# EAGLE design webserver (EAGLE 5.10)
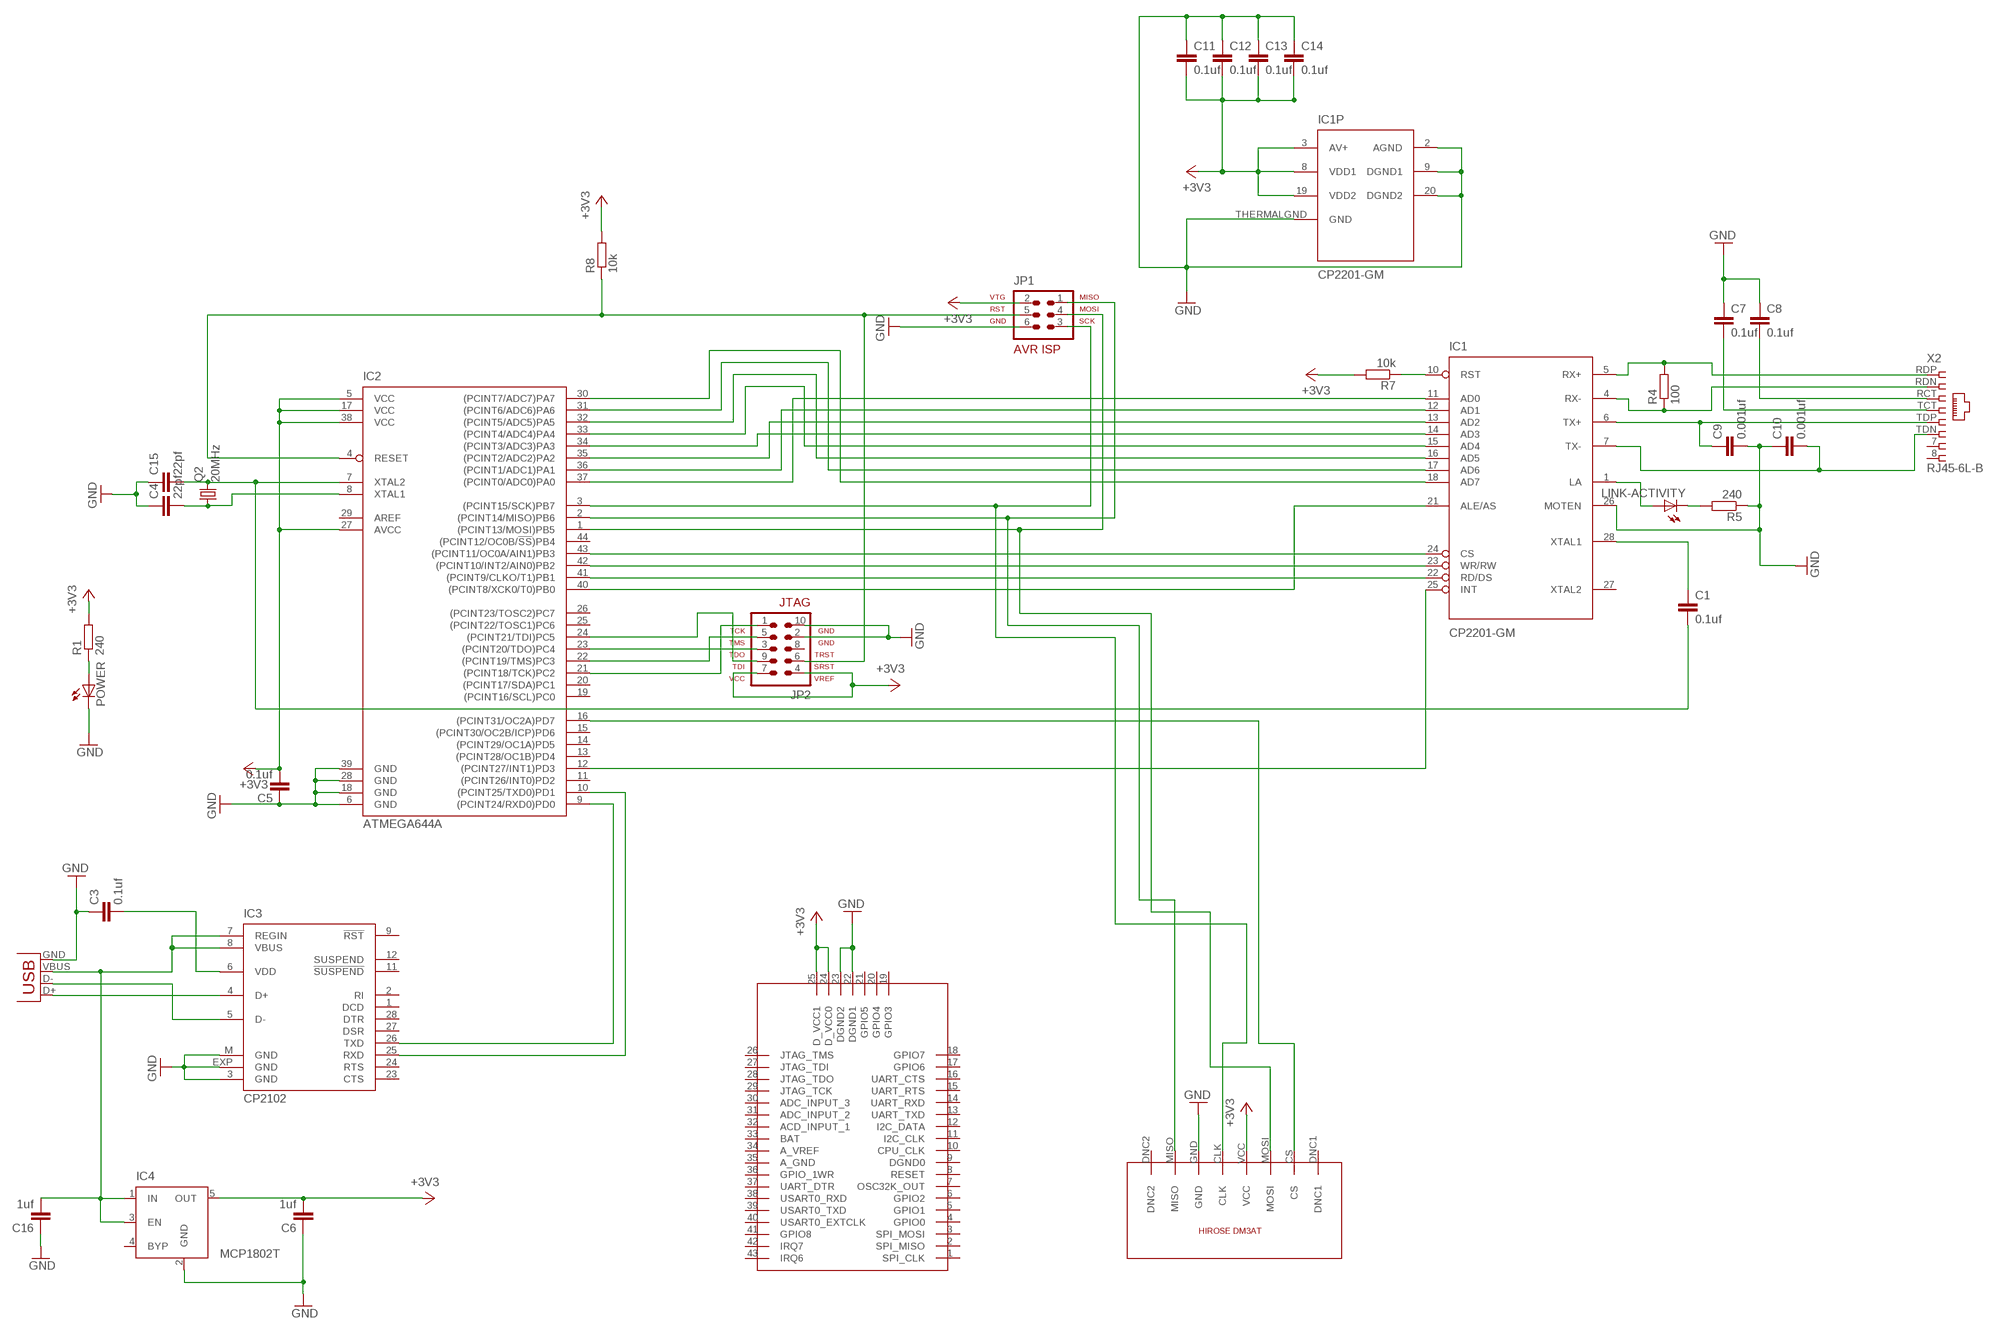
[diagram p0: schematic, sheet 1]

## Parts
C1  0.1uf  C-EUC0603  [C0603]
C3  0.1uf  C-EUC0603  [C0603]
C4  22pf  C-EUC0603  [C0603]
C5  0.1uf  C-EUC0603  [C0603]
C6  1uf  C-EUC0603  [C0603]
C7  0.1uf  C-EUC0603  [C0603]
C8  0.1uf  C-EUC0603  [C0603]
C9  0.001uf  C-EUC0603  [C0603]
C10  0.001uf  C-EUC0603  [C0603]
C11  0.1uf  C-EUC0603  [C0603]
C12  0.1uf  C-EUC0603  [C0603]
C13  0.1uf  C-EUC0603  [C0603]
C14  0.1uf  C-EUC0603  [C0603]
C15  22pf  C-EUC0603  [C0603]
C16  1uf  C-EUC0603  [C0603]
IC1  CP2201-GM  [QFN-28]
IC2  ATMEGA644A  [TQFP44]
IC3  CP2102  [MLP28]
IC4  MCP1802T  MIC5219XX  [SOT23-5]
JP1  AVR-ISP-6  [AVR-ISP-6]
JP2  AVR-JTAG-10  [AVR-JTAG-10]
LINK-ACTIVITY  LED3MM  [LED3MM]
MINI-USB  USB-MB-H  [USB-MB-H]
POWER  LED3MM  [LED3MM]
Q2  20MHz  CRYTALHC49S  [HC49/S]
R1  240  R-EU_R0603  [R0603]
R4  100  R-EU_R0603  [R0603]
R5  240  R-EU_R0603  [R0603]
R7  10k  R-EU_R0603  [R0603]
R8  10k  R-EU_R0603  [R0603]
U$1  DM3AT  [DM3AT]
U$2  ATZB-24  [ATZB-24-A2]
X2  RJ45-6L-B  [RJ45-NO-SHIELD]

## Nets
+3V3: C5.2 C6.2 C11.2 C12.2 C13.2 C14.2 IC1.3(AV+) IC1.8(VDD1) IC1.19(VDD2) IC2.5(VCC) IC2.17(VCC) IC2.27(AVCC) IC2.38(VCC) IC4.5(OUT) JP1.2 JP2.4 JP2.7 R1.2 R7.2 R8.2 U$1.VCC U$2.24(D_VCC0) U$2.25(D_VCC1)
GND: C3.1 C4.1 C5.1 C6.1 C7.1 C8.1 C9.2 C10.1 C11.1 C12.1 C13.1 C14.1 C15.1 C16.1 IC1.2(AGND) IC1.9(DGND1) IC1.20(DGND2) IC1.26(MOTEN) IC1.THERMALGND(GND) IC2.6(GND) IC2.18(GND) IC2.28(GND) IC2.39(GND) IC3.3(GND) IC3.EXP(GND) IC3.M(GND) IC4.2(GND) JP1.6 JP2.2 JP2.10 MINI-USB.GND POWER.K(C) R5.1 U$1.GND U$2.22(DGND1) U$2.23(DGND2)
N$1: IC1.11(AD0) IC2.37((PCINT0/ADC0)PA0)
N$2: IC1.12(AD1) IC2.36((PCINT1/ADC1)PA1)
N$3: IC1.13(AD2) IC2.35((PCINT2/ADC2)PA2)
N$4: IC1.14(AD3) IC2.34((PCINT3/ADC3)PA3)
N$5: IC1.15(AD4) IC2.33((PCINT4/ADC4)PA4)
N$6: IC1.16(AD5) IC2.32((PCINT5/ADC5)PA5)
N$7: IC1.17(AD6) IC2.31((PCINT6/ADC6)PA6)
N$8: IC1.18(AD7) IC2.30((PCINT7/ADC7)PA7)
N$9: IC1.25(INT) IC2.12((PCINT27/INT1)PD3)
N$10: C1.1 IC1.28(XTAL1)
N$11: IC1.21(ALE/AS) IC2.40((PCINT8/XCK0/T0)PB0)
N$12: IC2.2((PCINT14/MISO)PB6) JP1.1 U$1.MISO
N$13: IC2.1((PCINT13/MOSI)PB5) JP1.4 U$1.MOSI
N$14: POWER.A R1.1
N$15: C16.2 IC3.7(REGIN) IC3.8(VBUS) IC4.1(IN) IC4.3(EN) MINI-USB.VBUS
N$17: IC2.3((PCINT15/SCK)PB7) JP1.3 U$1.CLK
N$18: IC2.21((PCINT18/TCK)PC2) JP2.1
N$19: IC2.22((PCINT19/TMS)PC3) JP2.5
N$20: IC2.4(RESET) JP1.5 JP2.6 R8.1
N$21: IC1.1(LA) LINK-ACTIVITY.A
N$22: IC2.23((PCINT20/TDO)PC4) JP2.3
N$23: C1.2 C15.2 IC2.7(XTAL2) Q2.2
N$25: IC1.24(CS) IC2.43((PCINT11/OC0A/AIN1)PB3)
N$26: C4.2 IC2.8(XTAL1) Q2.1
N$27: IC2.24((PCINT21/TDI)PC5) JP2.9
N$29: IC2.16((PCINT31/OC2A)PD7) U$1.CS
N$30: IC2.9((PCINT24/RXD0)PD0) IC3.26(TXD)
N$31: IC2.10((PCINT25/TXD0)PD1) IC3.25(RXD)
N$34: IC3.4(D+) MINI-USB.D+
N$35: IC1.22(RD/DS) IC2.41((PCINT9/CLKO/T1)PB1)
N$36: IC1.23(WR/RW) IC2.42((PCINT10/INT2/AIN0)PB2)
N$37: LINK-ACTIVITY.K(C) R5.2
N$41: IC3.5(D-) MINI-USB.D-
N$44: C3.2 IC3.6(VDD)
N$46: IC1.5(RX+) R4.2 X2.RDP
N$47: IC1.4(RX-) R4.1 X2.RDN
N$48: C9.1 IC1.6(TX+) X2.TDP
N$49: C10.2 IC1.7(TX-) X2.TDN
N$50: C8.2 X2.RCT
N$51: C7.2 X2.TCT
N$53: IC1.10(RST) R7.1
Unconnected: IC1.27(XTAL2) IC2.11((PCINT26/INT0)PD2) IC2.13((PCINT28/OC1B)PD4) IC2.14((PCINT29/OC1A)PD5) IC2.15((PCINT30/OC2B/ICP)PD6) IC2.19((PCINT16/SCL)PC0) IC2.20((PCINT17/SDA)PC1) IC2.25((PCINT22/TOSC1)PC6) IC2.26((PCINT23/TOSC2)PC7) IC2.29(AREF) IC2.44((PCINT12/OC0B/!SS!)PB4) IC3.1(DCD) IC3.2(RI) IC3.9(!RST) IC3.11(!SUSPEND) IC3.12(SUSPEND) IC3.23(CTS) IC3.24(RTS) IC3.27(DSR) IC3.28(DTR) IC4.4(BYP) JP2.8 U$1.DNC1 U$1.DNC2 U$2.1(SPI_CLK) U$2.2(SPI_MISO) U$2.3(SPI_MOSI) U$2.4(GPIO0) U$2.5(GPIO1) U$2.6(GPIO2) U$2.7(OSC32K_OUT) U$2.8(RESET) U$2.9(DGND0) U$2.10(CPU_CLK) U$2.11(I2C_CLK) U$2.12(I2C_DATA) U$2.13(UART_TXD) U$2.14(UART_RXD) U$2.15(UART_RTS) U$2.16(UART_CTS) U$2.17(GPIO6) U$2.18(GPIO7) U$2.19(GPIO3) U$2.20(GPIO4) U$2.21(GPIO5) U$2.26(JTAG_TMS) U$2.27(JTAG_TDI) U$2.28(JTAG_TDO) U$2.29(JTAG_TCK) U$2.30(ADC_INPUT_3) U$2.31(ADC_INPUT_2) U$2.32(ACD_INPUT_1) U$2.33(BAT) U$2.34(A_VREF) U$2.35(A_GND) U$2.36(GPIO_1WR) U$2.37(UART_DTR) U$2.38(USART0_RXD) U$2.39(USART0_TXD) U$2.40(USART0_EXTCLK) U$2.41(GPIO8) U$2.42(IRQ7) U$2.43(IRQ6) X2.7 X2.8

## Library data of the parts
C1 C3-C16 = rcl:C-EU: CAPACITOR, European symbol
IC1 = silabs-eth:CP2201-GM: SINGLE-CHIP ETHERNET CONTROLLER Integrated IEEE 802.3 MAC and 10 BASE-T PHY
IC2 = atmel:ATMEGA644: 8-bit Microcontroller with 64K Bytes In-System Programmable Flash Source: http://www.atmel.com/dyn/resources/prod_documents/doc2593.pdf
IC3 = silabs:CP210*: Single-Chip USB to UART Bridge Source: www.silabs.com .. CP2101.pdf / cp2102.pdf
IC4 = v-reg-micrel:MIC5219XX: VOLTAGE REGULATOR
JP1 = atmel-isp:AVR-ISP-6: AVR ISP-6 Serial Programming Header
JP2 = atmel-isp:AVR-JTAG-10: AVR JTAG Debug/Programming Header
LINK-ACTIVITY POWER = led:LED: LED OSRAM: - CHIPLED LG R971, LG N971, LY N971, LG Q971, LY Q971, LO R971, LY R971 LH N974, LH R974 LS Q976, LO Q976, LY Q976 LO Q996 - Hyper CHIPLED LW Q18S LB Q993, LB Q99A, LB R99A - SideLED LS A670, LO A670, LY A670, LG A670, LP A670 LB A673, LV A673, LT A673, LW A673 LH A674 LY A675 LS A676, LA A676, LO A676, LY A676, LW A676 LS A679, LY A679, LG A679 - Hyper Micro SIDELED® LS Y876, LA Y876, LO Y876, LY Y876 LT Y87S - SmartLED LW L88C, LW L88S LB L89C, LB L89S, LG L890 LS L89K, LO L89K, LY L89K LS L896, LA L896, LO L896, LY L896 - TOPLED LS T670, LO T670, LY T670, LG T670, LP T670 LSG T670, LSP T670, LSY T670, LOP T670, LYG T670 LG T671, LOG T671, LSG T671 LB T673, LV T673, LT T673, LW T673 LH T674 LS T676, LA T676, LO T676, LY T676, LB T676, LH T676, LSB T676, LW T676 LB T67C, LV T67C, LT T67C, LS T67K, LO T67K, LY T67K, LW E67C LS E67B, LA E67B, LO E67B, LY E67B, LB E67C, LV E67C, LT E67C LW T67C LS T679, LY T679, LG T679 LS T770, LO T770, LY T770, LG T770, LP T770 LB T773, LV T773, LT T773, LW T773 LH T774 LS E675, LA E675, LY E675, LS T675 LS T776, LA T776, LO T776, LY T776, LB T776 LHGB T686 LT T68C, LB T68C - Hyper Mini TOPLED® LB M676 - Mini TOPLED Santana® LG M470 LS M47K, LO M47K, LY M47K Source: http://www.osram.convergy.de LUXEON: - LUMILED® LXK2-PW12-R00, LXK2-PW12-S00, LXK2-PW14-U00, LXK2-PW14-V00 LXK2-PM12-R00, LXK2-PM12-S00, LXK2-PM14-U00 LXK2-PE12-Q00, LXK2-PE12-R00, LXK2-PE12-S00, LXK2-PE14-T00, LXK2-PE14-U00 LXK2-PB12-K00, LXK2-PB12-L00, LXK2-PB12-M00, LXK2-PB14-N00, LXK2-PB14-P00, LXK2-PB14-Q00 LXK2-PR12-L00, LXK2-PR12-M00, LXK2-PR14-Q00, LXK2-PR14-R00 LXK2-PD12-Q00, LXK2-PD12-R00, LXK2-PD12-S00 LXK2-PH12-R00, LXK2-PH12-S00 LXK2-PL12-P00, LXK2-PL12-Q00, LXK2-PL12-R00 Source: www.luxeon.com KINGBRIGHT: KA-3528ASYC Source: www.kingbright.com
MINI-USB = SparkFun:USB: USB Connectors USB-B-PTH is fully proven SKU : PRT-00139 USB-miniB is fully proven SKU : PRT-00587 USB-A-PCB is untested. USB-A-H is throughly reviewed, but untested. Spark Fun Electronics SKU : PRT-00437 USB-B-SMT is throughly reviewed, but untested. Needs silkscreen touching up. USB-A-S has not been used/tested USB-MB-H has not been used/tested
Q2 = crystal:CRYTAL: CRYSTAL
R1 R4 R5 R7 R8 = resistor:R-EU_: RESISTOR, European symbol
U$1 = HIROSE-DM3AT:DM3AT
U$2 = Atmel-zigbit:ATZB-24
X2 = con-tycoelectronics:RJ45: CORCOM Modular RJ Jacks No Shield Source: www.tycoelectronics.com .. ENG_DS_1654001_1099_RJ_L_0507.pdf

## Board
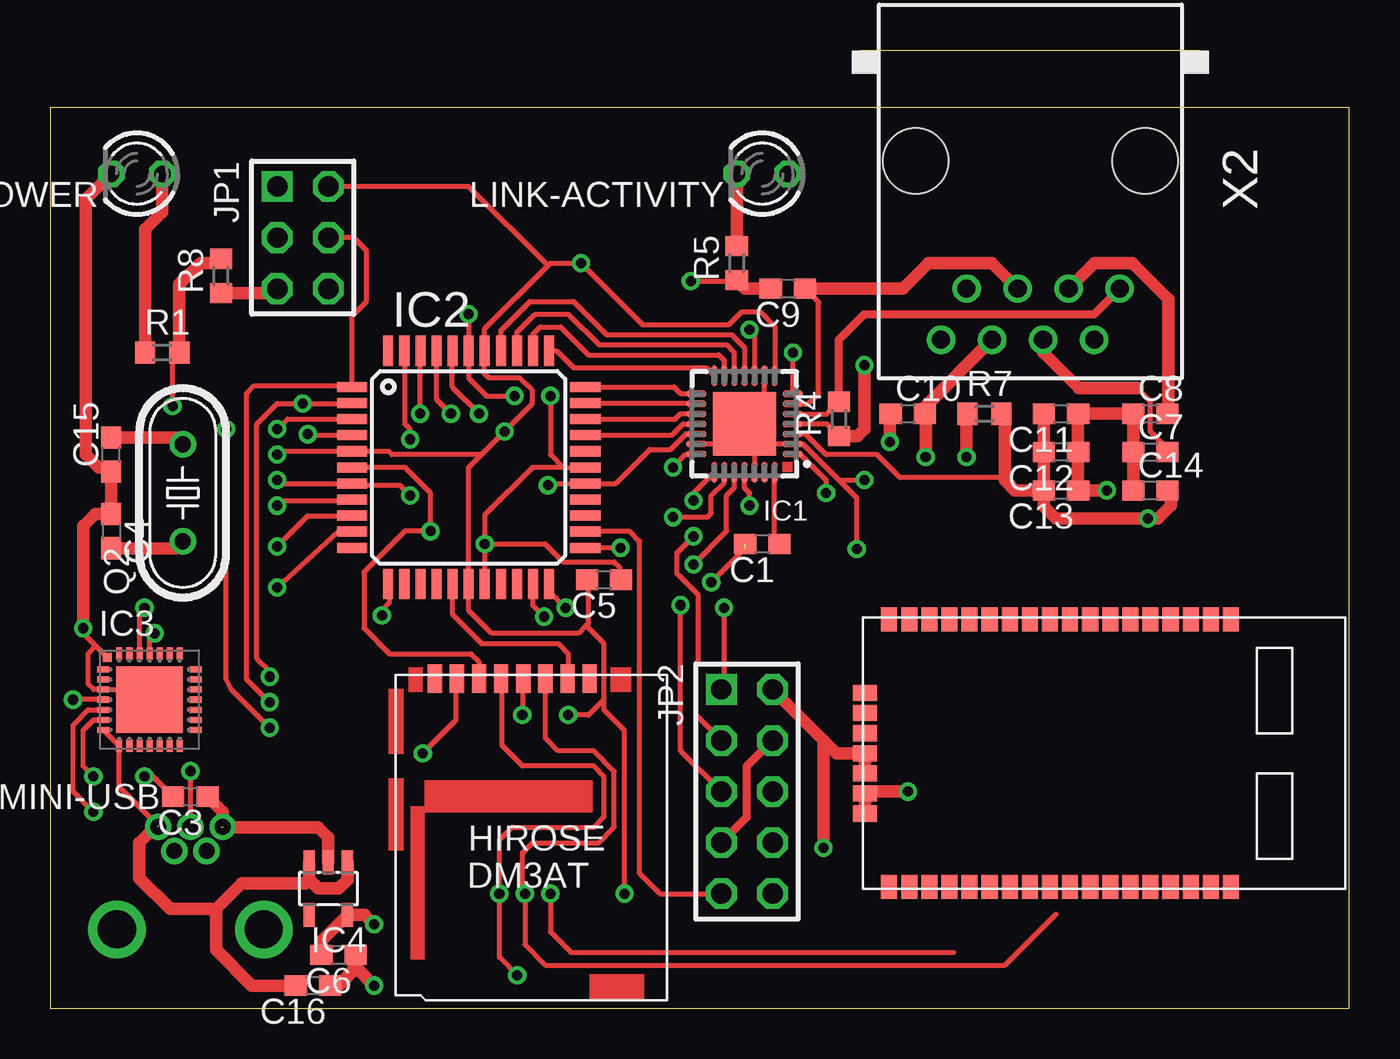
[diagram p1: board, top side]
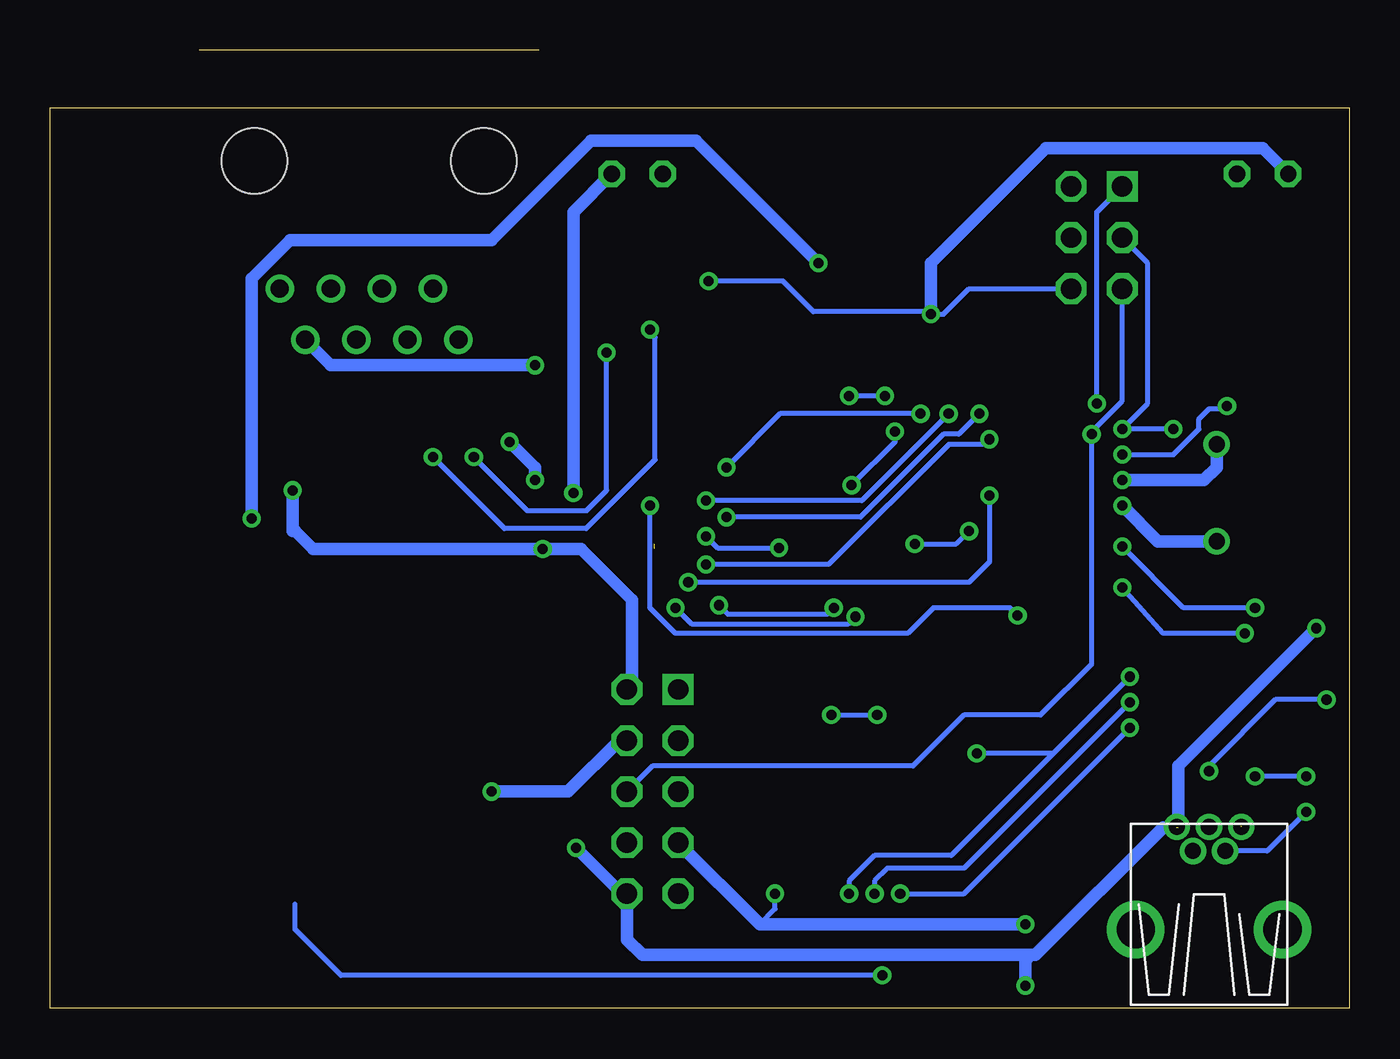
[diagram p2: board, bottom side, seen from below]

Size 64.62 x 44.82 mm. Coordinates in mm from the lower left corner, seen from the top.
Outline: 0,0 64.62,0 64.62,44.82 0,44.82 0,0
Copper layers (1*16): Top 0.035mm / dielectric 1.5mm / Bottom 0.035mm
Design rules "default *": minimum track width 10mil, minimum drill 12mil, track to track 6mil, track to pad 6mil, pad to pad 6mil, via to via 6mil, smd to smd 6mil, copper to edge 10mil, drill to drill 8mil, minimum pad ring 10mil, minimum via ring 8mil, stop-mask expansion 4mil, vias tented up to drill 0mil, thermal gap 10mil

### Footprints (pad centres in the part's own frame; a part is rotated, then mirrored left to right if it is on the bottom)
C0603 = smd 1.1 x 1: 1 -0.85,0; 2 0.85,0
QFN-28 = smd 1 x 0.3: 1 -2.4,1.5; 2 -2.4,1; 3 -2.4,0.5; 4 -2.4,0; 5 -2.4,-0.5; 6 -2.4,-1; 7 -2.4,-1.5; 15 2.4,-1.5; 16 2.4,-1; 17 2.4,-0.5; 18 2.4,0; 19 2.4,0.5; 20 2.4,1; 21 2.4,1.5 | smd 0.3 x 1: 8 -1.5,-2.4; 9 -1,-2.4; 10 -0.5,-2.4; 11 0,-2.4; 12 0.5,-2.4; 13 1,-2.4; 14 1.5,-2.4; 22 1.5,2.4; 23 1,2.4; 24 0.5,2.4; 25 0,2.4; 26 -0.5,2.4; 27 -1,2.4; 28 -1.5,2.4 | smd 3.15 x 3.15: THERMALGND 0,0
TQFP44 = smd 1.5 x 0.5: 1 -5.8,4; 2 -5.8,3.2; 3 -5.8,2.4; 4 -5.8,1.6; 5 -5.8,0.8; 6 -5.8,0; 7 -5.8,-0.8; 8 -5.8,-1.6; 9 -5.8,-2.4; 10 -5.8,-3.2; 11 -5.8,-4; 23 5.8,-4; 24 5.8,-3.2; 25 5.8,-2.4; 26 5.8,-1.6; 27 5.8,-0.8; 28 5.8,0; 29 5.8,0.8; 30 5.8,1.6; 31 5.8,2.4; 32 5.8,3.2; 33 5.8,4 | smd 0.5 x 1.5: 12 -4,-5.8; 13 -3.2,-5.8; 14 -2.4,-5.8; 15 -1.6,-5.8; 16 -0.8,-5.8; 17 0,-5.8; 18 0.8,-5.8; 19 1.6,-5.8; 20 2.4,-5.8; 21 3.2,-5.8; 22 4,-5.8; 34 4,5.8; 35 3.2,5.8; 36 2.4,5.8; 37 1.6,5.8; 38 0.8,5.8; 39 0,5.8; 40 -0.8,5.8; 41 -1.6,5.8; 42 -2.4,5.8; 43 -3.2,5.8; 44 -4,5.8
MLP28 = smd 0.6 x 0.3: 1 -2.3,1.5; 2 -2.3,1; 3 -2.3,0.5; 4 -2.3,0; 5 -2.3,-0.5; 6 -2.3,-1; 7 -2.3,-1.5; 15 2.3,-1.5; 16 2.3,-1; 17 2.3,-0.5; 18 2.3,0; 19 2.3,0.5; 20 2.3,1; 21 2.3,1.5 | smd 0.3 x 0.6: 8 -1.5,-2.3; 9 -1,-2.3; 10 -0.5,-2.3; 11 0,-2.3; 12 0.5,-2.3; 13 1,-2.3; 14 1.5,-2.3; 22 1.5,2.3; 23 1,2.3; 24 0.5,2.3; 25 0,2.3; 26 -0.5,2.3; 27 -1,2.3; 28 -1.5,2.3 | smd 3.3 x 3.3: EXP 0,0 | smd 0.435 x 0.435: M -2.103,2.103
SOT23-5 = smd 0.55 x 1.2: 1 -0.95,-1.3; 2 0,-1.3; 3 0.95,-1.3; 4 0.95,1.3; 5 -0.95,1.3
AVR-ISP-6 = drill 1.016 square: 1 -2.54,-1.27 | drill 1.016 octagon: 2 -2.54,1.27; 3 0,-1.27; 4 0,1.27; 5 2.54,-1.27; 6 2.54,1.27
AVR-JTAG-10 = drill 1.016 square: 1 -5.08,-1.27 | drill 1.016 octagon: 2 -5.08,1.27; 3 -2.54,-1.27; 4 -2.54,1.27; 5 0,-1.27; 6 0,1.27; 7 2.54,-1.27; 8 2.54,1.27; 9 5.08,-1.27; 10 5.08,1.27
LED3MM = drill 0.813 octagon: A -1.27,0; K 1.27,0
USB-MB-H = drill 0.8 round: D+ 5.1,0; D- 3.9,0.8; GND 5.1,-1.6; ID 3.9,-0.8; VBUS 5.1,1.6 | drill 1.9 round: P$6 0,-3.65; P$7 0,3.65
HC49/S = drill 0.813 round: 1 -2.413,0; 2 2.413,0
R0603 = smd 1 x 1.1: 1 -0.85,0; 2 0.85,0
DM3AT = smd 0.711 x 1.422: CLK -1.56,6.63; CS 1.74,6.63; DNC1 2.84,6.63; DNC2 -4.86,6.63; GND -2.66,6.63; MISO -3.76,6.63; MOSI 0.64,6.63; VCC -0.46,6.63
ATZB-24-A2 = smd 0.8 x 1.2: 1 8.45,6.65; 2 7.45,6.65; 3 6.45,6.65; 4 5.45,6.65; 5 4.45,6.65; 6 3.45,6.65; 7 2.45,6.65; 8 1.45,6.65; 9 0.45,6.65; 10 -0.55,6.65; 11 -1.55,6.65; 12 -2.55,6.65; 13 -3.55,6.65; 14 -4.55,6.65; 15 -5.55,6.65; 16 -6.55,6.65; 17 -7.55,6.65; 18 -8.55,6.65; 26 -8.55,-6.65; 27 -7.55,-6.65; 28 -6.55,-6.65; 29 -5.55,-6.65; 30 -4.55,-6.65; 31 -3.55,-6.65; 32 -2.55,-6.65; 33 -1.55,-6.65; 34 -0.55,-6.65; 35 0.45,-6.65; 36 1.45,-6.65; 37 2.45,-6.65; 38 3.45,-6.65; 39 4.45,-6.65; 40 5.45,-6.65; 41 6.45,-6.65; 42 7.45,-6.65; 43 8.45,-6.65 | smd 1.2 x 0.8: 19 -9.75,3; 20 -9.75,2; 21 -9.75,1; 22 -9.75,0; 23 -9.75,-1; 24 -9.75,-2; 25 -9.75,-3
RJ45-NO-SHIELD = drill 0.9 pad 1.4 round: 7 3.175,6.35; 8 4.445,8.89; RCT -1.905,6.35; RDN -3.175,8.89; RDP -4.445,6.35; TCT -0.635,8.89; TDN 1.905,8.89; TDP 0.635,6.35 | hole 3.251: -5.715,0; 5.715,0

### Placement (x,y rotation side)
C1  35.42,23.11 180 top
C3  6.97,10.54 180 top
C4  3.04,23.74 270 top
C5  27.55,21.33 180 top
C6  14.34,2.66 180 top
C7  54.72,27.68 0 top
C8  54.72,29.59 0 top
C9  36.69,35.81 180 top
C10  42.66,29.59 0 top
C11  50.28,29.59 180 top
C12  50.28,27.68 180 top
C13  50.28,25.78 180 top
C14  54.72,25.78 0 top
C15  3.04,27.55 90 top
C16  13.07,1.14 180 top
IC1  34.53,29.08 180 top
IC2  20.81,26.92 0 top
IC3  4.94,15.36 0 top
IC4  13.83,5.96 180 top
JP1  12.56,38.35 270 top
JP2  34.66,10.79 270 top
LINK-ACTIVITY  35.42,41.52 180 top
MINI-USB  6.97,3.93 90 top
POWER  4.3,41.52 180 top
Q2  6.59,25.65 90 top
R1  5.57,32.63 0 top
R4  39.23,29.33 90 top
R5  34.15,37.08 90 top
R7  46.47,29.59 0 top
R8  8.5,36.44 90 top
U$1  23.99,9.77 0 top
U$2  50.28,12.7 0 top
X2  48.75,42.16 180 top

### Tracks (layer width: path | path; a pad name or v marks a point on that pad's centre or on a via)
+3V3  (via drill 0.5)
  Top 0.254: IC1.8 36.05,31.5 36.05,33.9 35.29,34.67 34.4,34.67 33.77,34.03 29.45,34.03 v26.4,37.08 24.88,37.08 24.75,36.95 | 21.45,27.55 17.01,27.55 16.84,27.72 IC2.5 11.46,27.72 v11.29,27.55 | 21.45,27.55 v22.59,28.7 23.99,30.09 23.99,30.73 23.35,31.36 21.83,31.36 21.58,31.62 21.58,32.68 IC2.38 21.62,33.82 24.75,36.95 | IC1.3 37.58,28.57 38.59,27.55 41.13,27.55 42.28,26.41 47.23,26.41 47.48,26.66 | 21.45,27.55 20.81,26.92 IC2.17 20.81,19.81 21.96,18.66 26.28,18.66 26.66,19.04 | v6.08,29.97 6.08,32.29 R1.2 | JP1.2 20.81,40.89 24.75,36.95 | IC1.19 31.62,28.58 30.85,27.81 29.83,27.81 28.14,26.12 IC2.27 24.84,26.12 v24.75,26.03 | 50.02,24.38 50.02,24.25 | 26.66,19.04 26.78,19.17 26.78,21.24 C5.2 26.28,21.24 | U$1.VCC 23.53,14.65 v23.48,14.6 | v25.77,14.6 26.78,14.6 27.55,15.36 | 27.55,15.36 27.55,18.16 26.66,19.04 | 27.55,15.36 27.55,14.85 28.56,13.84 v28.56,5.71
  Top 0.406: JP2.4 34.66,12.06 34.66,9.52 JP2.7
  Top 0.61: C11.2 C12.2 C13.2 | C13.2 47.99,25.78 47.48,26.28 47.48,26.66 47.48,29.42 R7.2 | C13.2 49.43,24.98 50.02,24.38 v54.6,24.38 55.1,24.38 55.74,25.01 55.74,25.61 C14.2 | R1.2 6.43,36.02 7.48,37.08 8.28,37.08 R8.2 | v16.12,4.19 15.64,4.66 IC4.5 13.49,3.37 C6.2 | U$2.25 U$2.24 40.62,10.79 v42.66,10.79
  Bottom 0.254: v11.29,27.55 8.75,27.55 7.48,28.82 7.48,29.33 6.97,29.84 6.21,29.84 v6.08,29.97 | v22.59,28.7 22.59,28.19 v24.75,26.03 | v25.77,14.6 v23.48,14.6 | v28.56,5.71 28.56,4.95 29.32,4.19
  Bottom 0.61: JP2.7 29.32,4.19 v16.12,4.19 | v54.6,24.38 54.6,36.32 52.69,38.22 42.66,38.22 37.71,43.18 32.5,43.18 v26.4,37.08 | JP2.4 36.31,13.33 38.85,10.79 v42.66,10.79
GND  (via drill 0.5)  (1 unrouted)
  Top 0.254: v20.81,34.54 IC2.39 20.81,31.36 21.7,30.47 v23.1,30.47 | v21.62,23.11 IC2.18 | v21.62,23.11 21.62,24.54 23.99,26.92 25.51,26.92 | 25.51,26.92 IC2.28 | v24.88,30.47 24.88,27.55 25.51,26.92 | 39.23,26.28 37.44,28.08 IC1.2 35.53,28.08 IC1.THERMALGND | 39.23,26.28 v40.5,26.28 | 41.77,29.55 C10.1 | v21.62,23.11 24.62,23.11 25.51,22.22 28.05,22.22 28.31,21.97 28.31,21.42 C5.1 28.05,21.5 | IC2.6 17.64,26.92 18.91,25.65 v18.91,23.74 17.64,23.74 15.61,21.71 15.61,18.92 16.88,17.65 20.94,17.65 21.33,17.26 U$1.GND | v1.64,18.92 1.64,18.66 2.27,18.03 | 2.27,18.03 IC3.M | 2.27,18.03 1.89,17.65 1.89,16.12 2.15,15.86 IC3.3 4.44,15.86 IC3.EXP | IC1.20 33.53,28.08 IC1.THERMALGND | IC1.26 35.03,28.58 IC1.THERMALGND | IC1.9 35.53,30.08 IC1.THERMALGND | v31.86,36.19 34.11,36.19 R5.1 | 39.23,26.28 40.12,25.39 v40.12,22.86
  Top 0.61: C9.2 34.57,35.81 R5.1 | C14.1 C7.1 C8.1 C11.1 C12.1 C13.1 v52.56,25.78 | v41.77,28.19 41.77,29.55 | POWER.K 1.76,40.25 1.76,27.55 2.4,26.92 2.82,26.92 C15.1 C4.1 2.23,24.59 1.64,24 v1.64,18.92 | v38.47,8 38.47,13.33 | 38.47,13.33 JP2.2 | 7.82,10.45 C3.1 8.57,9.79 MINI-USB.GND 8.59,9.01 13.32,9.01 13.83,8.5 IC4.2 | C16.1 14.34,1.14 15.1,1.9 15.1,2.57 C6.1 15.19,2.07 v16.12,1.14 | U$2.23 U$2.22 39.1,12.7 38.47,13.33
  Bottom 0.254: v23.1,30.47 v24.88,30.47 | JP1.6 18.91,35.81 20.18,34.54 v20.81,34.54 20.94,34.67 26.66,34.67 28.18,36.19 v31.86,36.19 | v21.62,23.11 19.55,23.11 v18.91,23.74
  Bottom 0.61: v52.56,25.78 52.56,23.74 52.44,23.74 51.55,22.86 v40.12,22.86 38.21,22.86 35.67,20.32 35.67,16.12 JP2.2 | v40.5,26.28 40.5,26.92 v41.77,28.19 | v20.81,34.54 20.81,37.08 15.1,42.79 4.3,42.79 POWER.K | 15.86,2.66 35.17,2.66 35.93,3.42 JP2.10 36.18,5.71 v38.47,8 | 15.86,2.66 15.61,2.66 9.26,9.01 8.5,9.01 | v1.64,18.92 8.5,12.06 8.5,9.11 MINI-USB.GND | v16.12,1.14 16.12,2.41 15.86,2.66
N$1
  Top 0.254: IC2.37 22.41,33.73 23.86,35.17 26.02,35.17 27.67,33.52 33.9,33.52 34.53,32.89 IC1.11
N$2
  Top 0.254: IC2.36 23.21,33.64 24.12,34.54 25.77,34.54 27.29,33.02 33.64,33.02 34.02,32.63 34.02,31.49 IC1.12
N$3
  Top 0.254: IC2.35 24.02,33.55 24.37,33.9 25.39,33.9 26.78,32.51 33.26,32.51 33.52,32.25 33.52,31.49 IC1.13
N$4
  Top 0.254: IC2.34 25.17,32.72 26.02,31.87 32.64,31.87 IC1.14
N$5
  Top 0.254: IC2.33 31.04,30.92 31.36,30.6 32.11,30.6 IC1.15
N$6
  Top 0.254: IC2.32 32.09,30.12 IC1.16
N$7
  Top 0.254: IC2.31 31.09,29.32 31.36,29.59 32.12,29.59 IC1.17
N$8
  Top 0.254: IC2.30 30.92,28.52 31.48,29.08 IC1.18
N$9  (via drill 0.5)
  Top 0.254: IC1.25 34.53,25.9 34.78,25.65 v34.78,25.01 | v16.5,19.55 16.5,19.81 16.88,20.19 16.88,21.06 IC2.12
  Bottom 0.254: v34.78,25.01 34.78,19.93 33.52,18.66 21.96,18.66 20.69,19.93 16.88,19.93 v16.5,19.55
N$10
  Top 0.254: IC1.28 36.03,23.35 C1.1
N$11  (via drill 0.5)
  Top 0.254: IC1.21 31.63,27.58 v30.98,26.92 | v21.32,29.59 19.99,30.92 19.99,32.69 IC2.40
  Bottom 0.254: v30.98,26.92 28.31,29.59 v21.32,29.59
N$12  (via drill 0.5)
  Top 0.254: IC2.2 14.99,30.09 v12.56,30.09 11.29,30.09 10.27,29.08 10.27,17.39 10.91,16.76 v10.91,16.5 | 44.95,2.79 25.9,2.79 24.88,3.8 v24.88,5.71 | v18.53,12.7 20.18,14.35 20.18,16.35 U$1.MISO
  Bottom 0.254: JP1.1 12.56,39.62 v12.56,30.09 | v24.88,5.71 24.88,6.35 23.61,7.62 19.8,7.62 14.72,12.7 | 14.72,12.7 v10.91,16.5 | 14.72,12.7 v18.53,12.7
N$13  (via drill 0.5)
  Top 0.254: 50.02,4.69 47.48,2.15 24.62,2.15 23.61,3.17 v23.61,5.71 23.48,5.84 23.48,7.74 23.99,8.25 27.29,8.25 28.05,9.01 28.05,11.81 27.04,12.82 25.26,12.82 24.63,13.45 U$1.MOSI | JP1.4 15.1,38.35 15.74,37.71 15.74,35.17 15.01,34.45 IC2.1 14.95,30.98 10.15,30.98 9.77,30.6 9.77,16.38 v10.91,15.23
  Bottom 0.254: v23.61,5.71 23.61,6.35 22.97,6.98 19.16,6.98 v10.91,15.23
N$14
  Top 0.61: R1.1 4.72,38.77 5.57,39.62 POWER.A
N$15  (1 unrouted)
  Top 0.254: IC3.7 IC3.8 3.42,13.04 3.42,11.04 5.37,9.09
  Top 0.61: IC4.1 14.78,6.41 14.34,5.96 13.32,5.96 12.88,6.41 | 12.88,6.41 IC4.3 | 8.24,4.69 8.24,2.92 10.02,1.14 C16.2 | 8.24,4.69 8.24,4.95 9.51,6.22 12.69,6.22 12.88,6.41 | 8.24,4.69 7.99,4.95 5.96,4.95 4.43,6.47 4.43,8.25 5.21,9.03 MINI-USB.VBUS
N$17  (via drill 0.5)
  Top 0.254: v8.75,28.82 8.75,16.38 9,15.87 v10.91,13.96 | v11.29,28.82 11.8,29.33 15,29.33 IC2.3 | U$1.CLK 22.47,16.37 22.47,13.08 23.48,12.06 27.04,12.06 27.55,11.55 27.55,9.52 27.04,9.01 22.97,9.01 22.34,8.38 v22.34,5.71 22.34,2.54 v23.23,1.65
  Bottom 0.254: v8.75,28.82 v11.29,28.82 10.02,30.09 10.02,37.08 JP1.3 | v22.34,5.71 19.16,5.71 v10.91,13.96 | v23.23,1.65 50.15,1.65 52.44,3.93 52.44,5.2
N$18  (via drill 0.5)
  Top 0.254: v33.52,19.93 33.52,16 JP2.1 | IC2.21 24.02,20.04 v24.56,19.49
  Bottom 0.254: v33.52,19.93 32.69,19.11 24.94,19.11 v24.56,19.49
N$19  (via drill 0.5)
  Top 0.254: IC2.22 24.81,20.76 v25.64,19.93 | v31.36,20.06 31.36,12.82 JP2.5
  Bottom 0.254: v25.64,19.93 25.96,19.62 30.91,19.62 v31.36,20.06
N$20  (via drill 0.5)
  Top 0.254: IC2.4 12.87,28.52 v12.81,28.57
  Top 0.61: R8.1 11.07,35.59 JP1.5
  Bottom 0.254: JP1.5 11.29,30.22 12.81,28.7 v12.81,28.57 12.81,17.14 15.35,14.6 19.16,14.6 21.7,12.06 34.66,12.06 JP2.6
N$21  (via drill 0.5)
  Top 0.254: IC1.1 37.3,27.58 38.59,26.28 v38.59,25.65
  Bottom 0.61: LINK-ACTIVITY.A 38.59,39.62 v38.59,25.65
N$22  (via drill 0.5)
  Top 0.254: v28.37,22.92 IC2.23 | v31.99,23.49 31.17,22.66 31.17,21.65 32.24,20.57 32.24,17.27 32.12,17.14 32.12,14.6 JP2.3
  Bottom 0.254: v31.99,23.49 31.42,22.92 v28.37,22.92
N$23  (via drill 0.5)  (1 unrouted)
  Top 0.254: v11.29,26.28 11.46,26.12 IC2.7 15.1,26.03 17.39,26.03 v17.89,25.52 | v32.88,21.2 34.57,22.89
  Top 0.61: C15.2 6.25,28.4 Q2.2
  Bottom 0.254: v32.88,21.2 18.91,21.2 17.89,22.22 v17.89,25.52
  Bottom 0.61: v11.29,26.28 7.23,26.28 6.59,26.92 Q2.2
N$25  (via drill 0.5)
  Top 0.254: IC1.24 34.03,25.91 33.64,25.52 33.64,23.74 v31.99,22.09 | IC2.43 17.64,32.69 17.64,29.08 17.89,28.82 v17.89,28.32
  Bottom 0.254: v31.99,22.09 25.9,22.09 19.93,28.06 18.15,28.06 v17.89,28.32
N$26  (via drill 0.5)
  Top 0.254: v11.29,25.01 11.42,25.01 11.67,25.27 14.96,25.27 IC2.8
  Top 0.61: C4.2 6.25,22.89 Q2.1
  Bottom 0.61: Q2.1 9.51,23.24 v11.29,25.01
N$27
  Top 0.254: IC2.24 28.84,23.72 29.32,23.24 29.32,6.73 30.34,5.71 JP2.9
N$29
  Top 0.254: IC2.16 20.02,19.59 21.45,18.16 25.26,18.16 25.77,17.65 25.77,16.44 U$1.CS
N$30  (via drill 0.5)
  Top 0.254: IC3.26 4.44,19.69 v4.69,19.93 | v11.29,22.98 12.81,24.51 15,24.51 IC2.9
  Bottom 0.254: v4.69,19.93 8.24,19.93 v11.29,22.98
N$31  (via drill 0.5)
  Top 0.254: IC3.25 4.94,18.41 v5.19,18.66 | IC2.10 14.31,23.72 v11.29,20.95
  Bottom 0.254: v5.19,18.66 9.26,18.66 v11.29,20.95
N$34  (via drill 0.5)
  Top 0.254: IC3.4 v1.13,15.36 | v6.97,11.81 MINI-USB.D+
  Bottom 0.254: v1.13,15.36 3.67,15.36 6.97,12.06 v6.97,11.81
N$35  (via drill 0.5)
  Top 0.254: IC2.41 19.21,30.3 v19.93,29.59 | v31.99,25.27 31.99,25.64 IC1.22
  Bottom 0.254: v31.99,25.27 24.24,25.27 v19.93,29.59
N$36  (via drill 0.5)
  Top 0.254: IC1.23 33.53,26.17 32.88,25.52 32.88,24.63 32.69,24.44 v30.98,24.44 | v18.4,29.59 18.4,32.71 IC2.42
  Bottom 0.254: v30.98,24.44 24.31,24.44 20.18,28.57 19.42,28.57 v18.4,29.59
N$37
  Top 0.61: R5.2 LINK-ACTIVITY.K
N$41  (via drill 0.5)
  Top 0.254: IC3.5 2.63,14.85 1.89,14.85 1.13,14.09 1.13,10.79 v2.15,9.77
  Bottom 0.254: MINI-USB.D- 4.09,7.83 v2.15,9.77
N$44  (via drill 0.5)
  Top 0.254: IC3.6 2.16,14.36 1.64,13.84 1.64,12.06 v2.15,11.55 | v4.69,11.55 5.11,11.55 C3.2
  Bottom 0.254: v2.15,11.55 v4.69,11.55
N$46
  Top 0.254: IC1.5 38.63,29.58 R4.2
  Top 0.406: X2.RDP 51.93,34.54 40.5,34.54 39.23,33.27 R4.2
N$47  (via drill 0.5)
  Top 0.254: IC1.4 38.63,29.08 R4.1
  Top 0.61: R4.1 40.16,28.48 40.5,28.82 v40.5,32
  Bottom 0.61: v40.5,32 50.66,32 X2.RDN
N$48
  Top 0.254: IC1.6 37.69,30.08 38.21,30.6 38.21,35.14 C9.1
  Top 0.61: C9.1 42.41,35.81 43.67,37.08 46.85,37.08 X2.TDP
N$49  (via drill 0.5)
  Top 0.254: 43.51,29.93 C10.2 43.55,29.55 | IC1.7 36.93,32.62 v36.94,32.63
  Top 0.61: 43.51,29.93 X2.TDN | v43.55,27.43 43.55,29.55
  Bottom 0.254: v36.94,32.63 36.94,25.78 37.96,24.76 40.88,24.76 v43.55,27.43
N$50
  Top 0.61: X2.RCT 51.93,37.08 53.84,37.08 55.61,35.3 55.61,29.62 C8.2
N$51
  Top 0.254: C7.2 55.57,27.85 54.72,28.7 54.72,30.22 54.09,30.86
  Top 0.61: 54.09,30.86 51.17,30.86 49.39,32.63 X2.TCT
N$53  (via drill 0.5)
  Top 0.254: IC1.10 35.03,33.53 v34.78,33.78 | 45.58,29.55 R7.1
  Top 0.61: v45.58,27.43 45.58,29.55
  Bottom 0.254: v45.58,27.43 42.02,23.87 37.96,23.87 34.53,27.3 34.53,33.4 34.78,33.65 v34.78,33.78